# EAGLE schematic LM386N-stage-1-rev-1 (EAGLE 7.5.0)
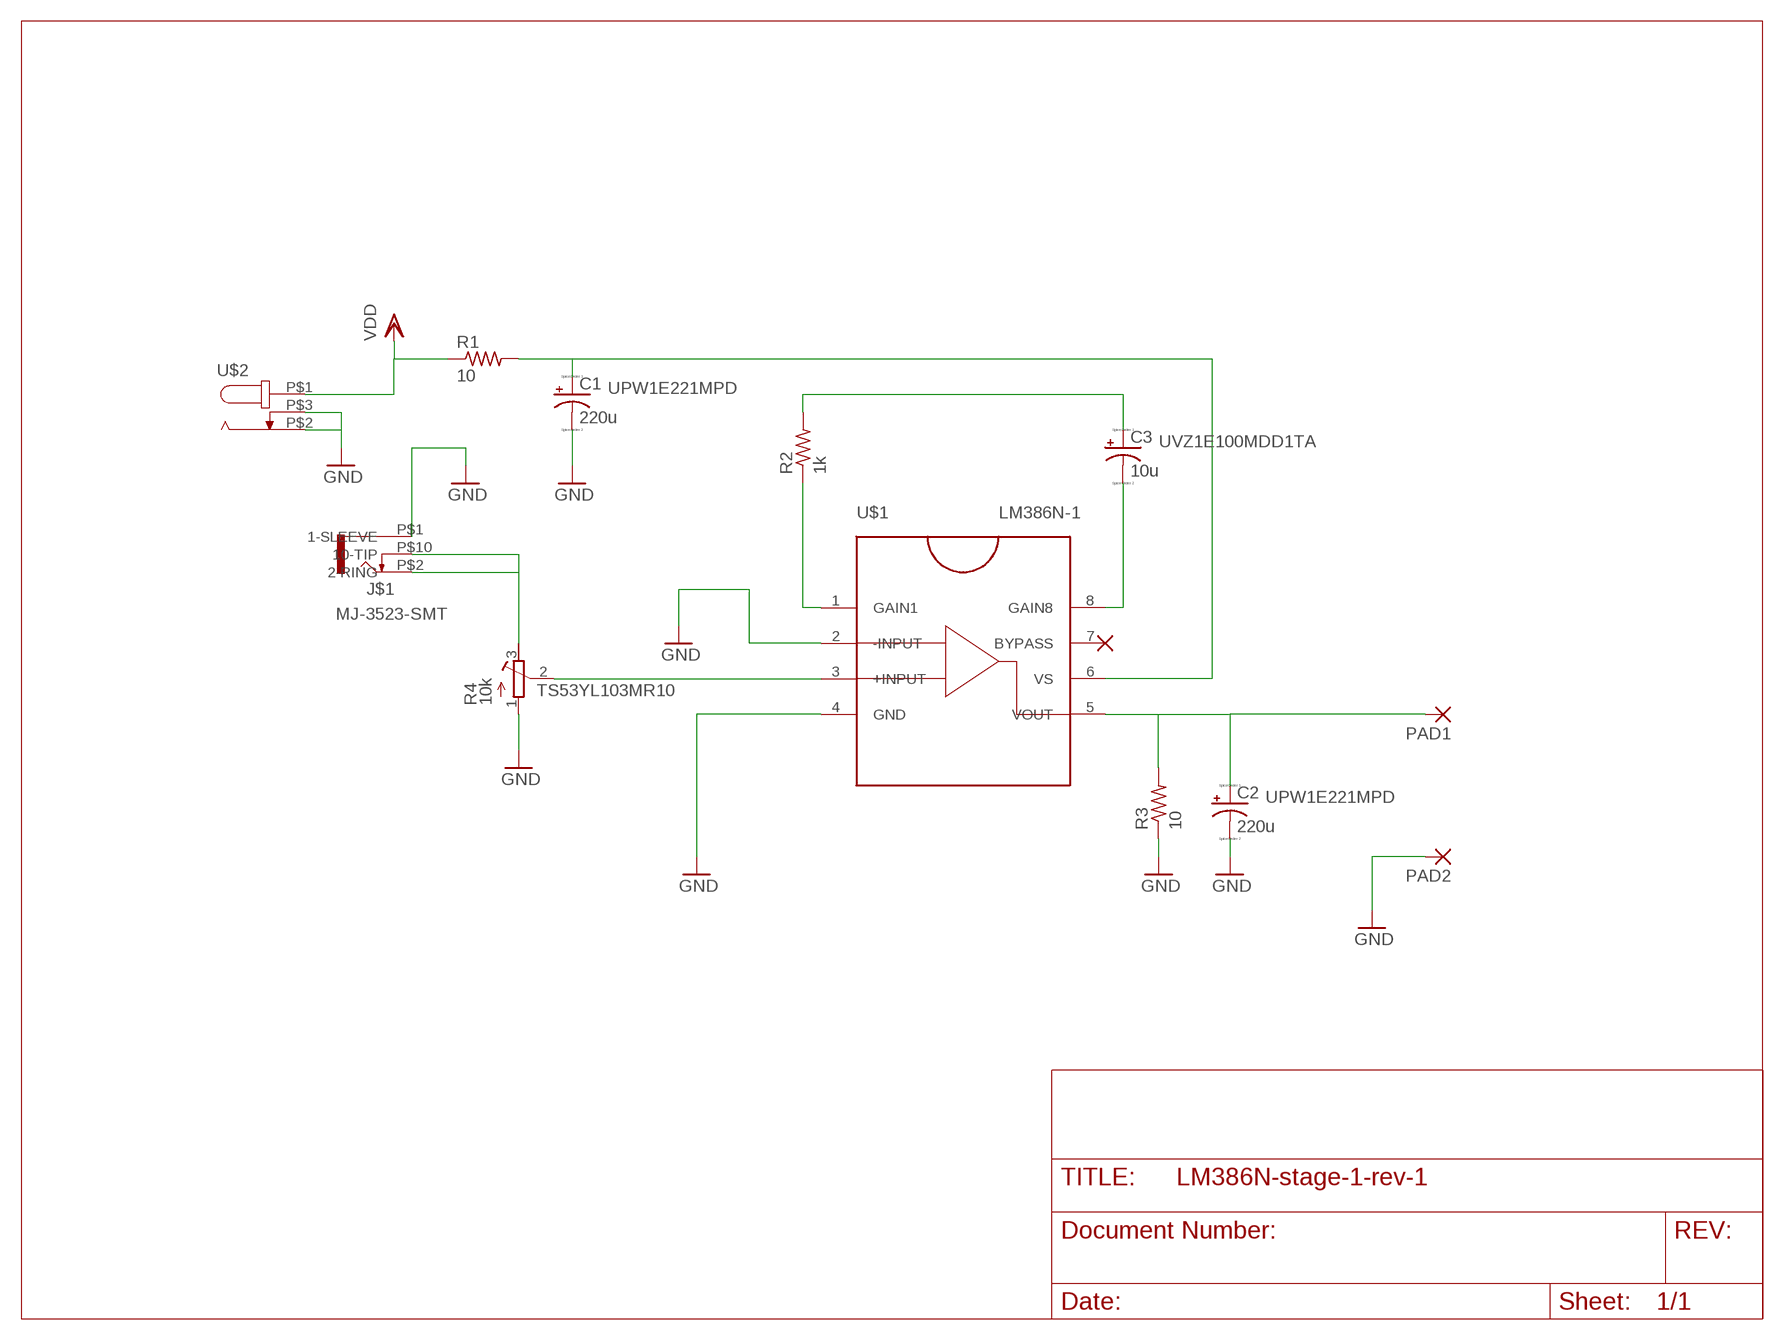
[diagram p0: schematic, sheet 1]

## Parts
C1  220u  CPOL-USE3.5-8  [E3,5-8]
C2  220u  CPOL-USE3.5-8  [E3,5-8]
C3  10u  CPOL-USE2-5  [E2-5]
J$1  CONN-TRS-3.5MM  [MJ-3523-SMT-TR]
PAD1  WIREPAD2,54/1,1  [2,54/1,1]
PAD2  WIREPAD2,54/1,1  [2,54/1,1]
R1  10  R-US_0207/10  [0207/10]
R2  1k  R-US_0207/10  [0207/10]
R3  10  R-US_0207/10  [0207/10]
R4  10k  R-TRIMMTSM53YL  [RTRIMTSM53YL]
U$1  LM386N-1  [DIL08]
U$2  PJ-036AH-SMT-TR  [PJ-036AH-SMT-TR]

## Nets
+INPUT: R4.2(S) U$1.3(+INPUT)
GAIN1: R2.1 U$1.1(GAIN1)
GAIN8: C3.- U$1.8(GAIN8)
GND: C1.- C2.- J$1.P$1(1-SLEEVE) PAD2.1(P) R3.1 R4.1(A) U$1.2(-INPUT) U$1.4(GND) U$2.P$2 U$2.P$3
MIC-IN: J$1.P$2(2-RING) J$1.P$10(10-TIP) R4.3(E)
N$3: C3.+ R2.2
OUTPUT: C2.+ PAD1.1(P) R3.2 U$1.5(VOUT)
VDD: R1.1 U$2.P$1
VS: C1.+ R1.2 U$1.6(VS)
Unconnected: U$1.7(BYPASS)

## Library data of the parts
C1 C2 = resistor:CPOL-US: POLARIZED CAPACITOR, American symbol; HYPERLINK: http://www.mouser.com/Search/ProductDetail.aspx?qs=2f4LZoVrW3trEPRv0o%2fUEw%3d%3d; NICHICON: UPW1E221MPD; SPICEPREFIX: C
C3 = resistor:CPOL-US: POLARIZED CAPACITOR, American symbol; HYPERLINK: http://www.mouser.com/Search/ProductDetail.aspx?qs=jmYbQePlcaCt5vCuNlMG5w%3d%3d; NICHICON: UVZ1E100MDD1TA; SPICEPREFIX: C
J$1 = connector-3.5mm:CONN-TRS-3.5MM: CUI Inc. Phone Connectors JACK 3.5MM SMT PCB Mouser http://www.mouser.com/ProductDetail/CUI/MJ-3523-SMT-TR/?qs=sGAEpiMZZMv0W4pxf2HiVz9SCMkER55fpzTQMC1TF95j8vo3CpLkdQ%3d%3d Datasheet http://www.mouser.com/ds/2/670/mj-3523-smt-516097.pdf; CUI: MJ-3523-SMT
PAD1 PAD2 = wirepad:WIREPAD: Wire PAD connect wire on PCB
R1-R3 = resistor:R-US_: RESISTOR, American symbol
R4 = resistor:R-TRIMM: Trimm resistor; HYPERLINK: http://www.mouser.com/ProductDetail/Vishay-Sfernice/TS53YL103MR10/?qs=sGAEpiMZZMvygUB3GLcD7vuChgoywSWu9V4boi5lpwU%3d; VISHAY: TS53YL103MR10
U$1 = national-semiconductor:LM386N-1: LM386 Low Voltage Audio Power Amplifier
U$2 = DC-Jack:PJ-036AH-SMT-TR: CUI Inc. 2 mm ID contact, 6.3 mm OD contact Mouser: http://www.mouser.com/ProductDetail/CUI/PJ-036AH-SMT-TR/?qs=sGAEpiMZZMv1TUPJeFpwbqPioV%2fJqV42m7KZMyWtinQvIUPHJNUYcg%3d%3d Datasheet: http://www.cui.com/product/resource/pj-036ah-smt.pdf; CUI: PJ-036AH-SMT-TR

## Net classes
0 default: clearance 0.205 mm